# EAGLE design 308_usb_memory (EAGLE 9.6.2)
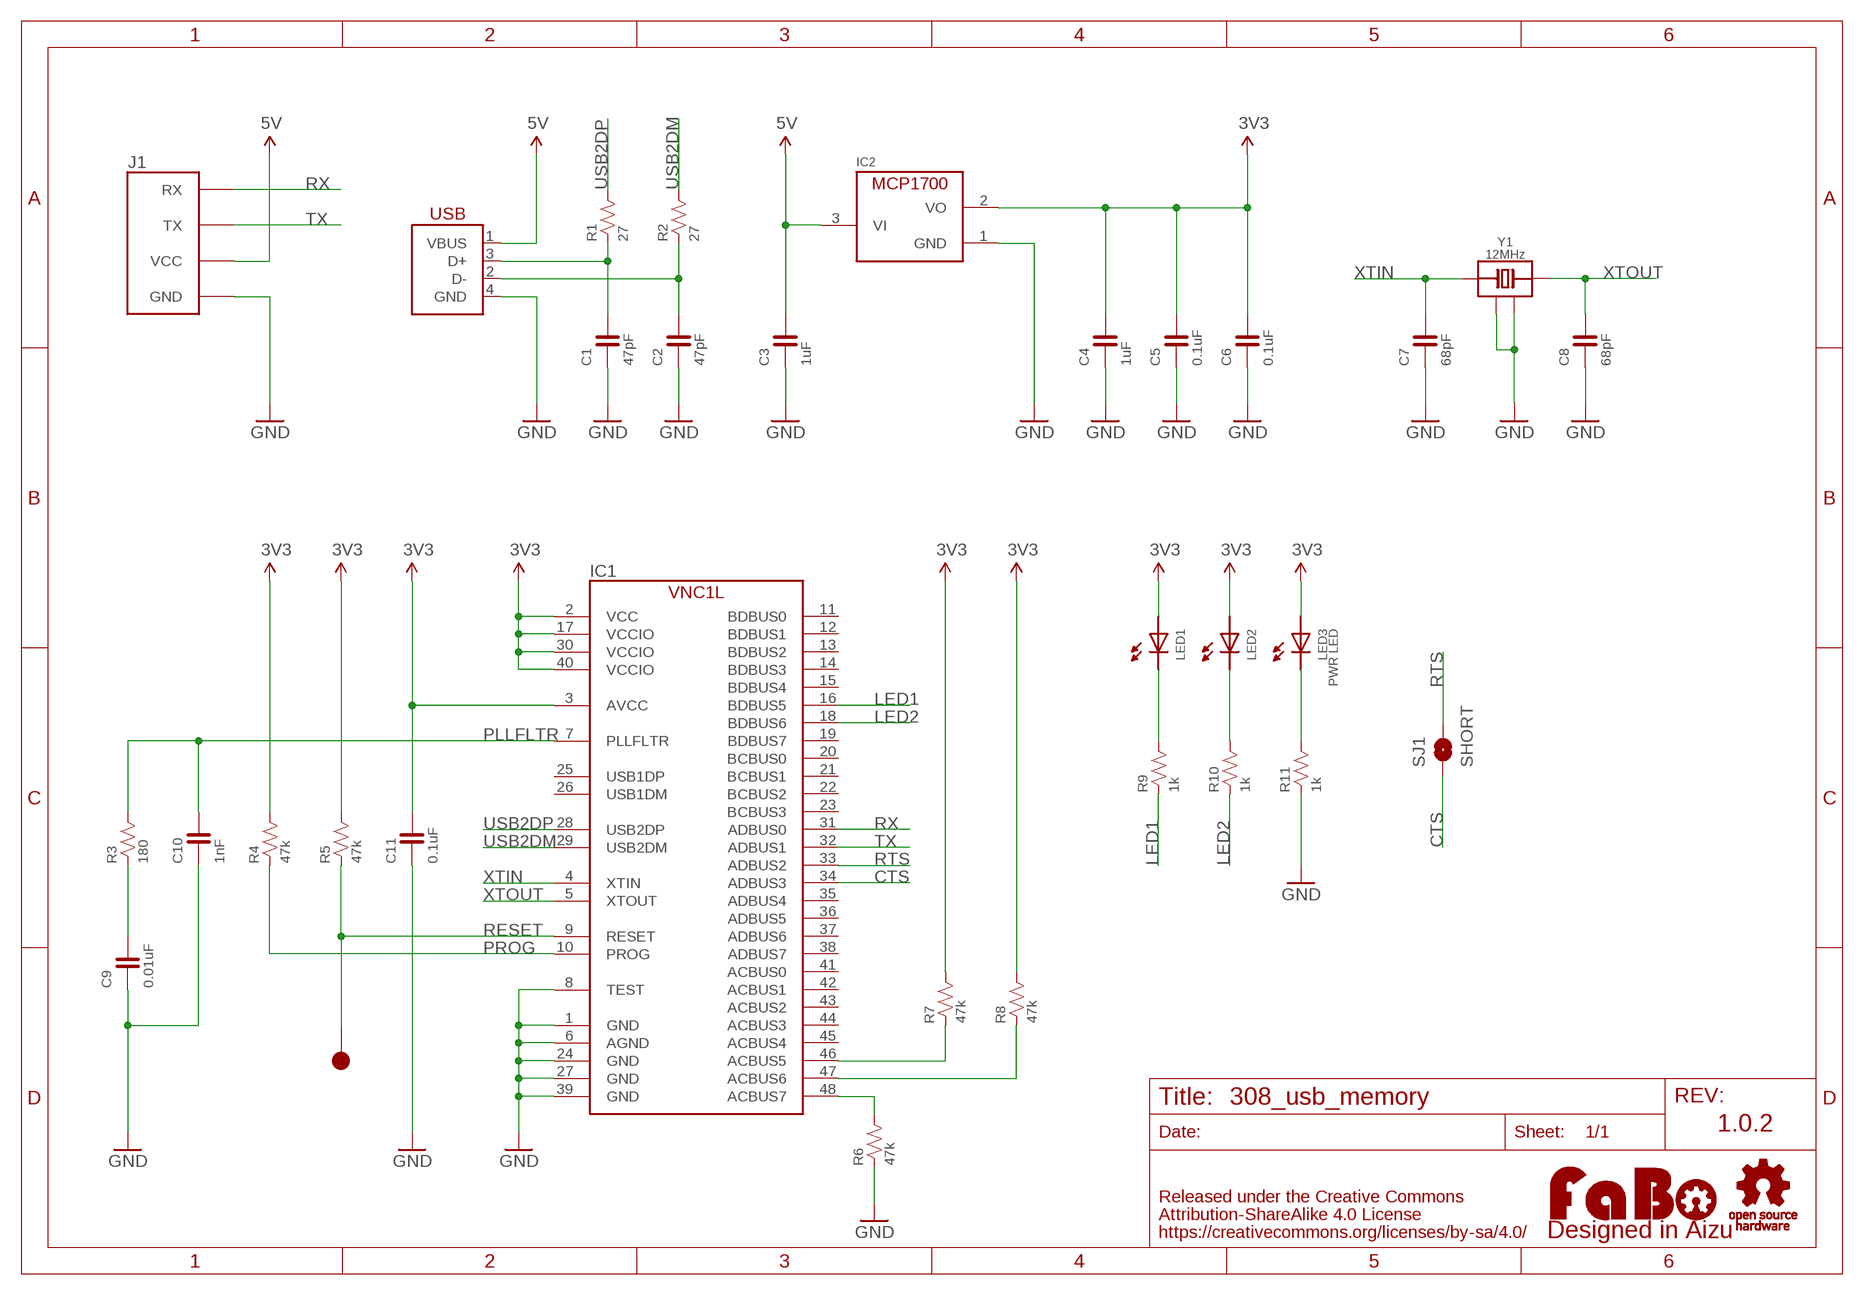
[diagram p0: schematic, sheet 1]

## Parts
C1  47pF  CAPACITOR-0603_NARROW  [0603-NARROW]
C2  47pF  CAPACITOR-0603_NARROW  [0603-NARROW]
C3  1uF  CAPACITOR-0603_NARROW  [0603-NARROW]
C4  1uF  CAPACITOR-0603_NARROW  [0603-NARROW]
C5  0.1uF  CAPACITOR-0603_NARROW  [0603-NARROW]
C6  0.1uF  CAPACITOR-0603_NARROW  [0603-NARROW]
C7  68pF  CAPACITOR-0603_NARROW  [0603-NARROW]
C8  68pF  CAPACITOR-0603_NARROW  [0603-NARROW]
C9  0.01uF  CAPACITOR-0603_NARROW  [0603-NARROW]
C10  1nF  CAPACITOR-0603_NARROW  [0603-NARROW]
C11  0.1uF  CAPACITOR-0603_NARROW  [0603-NARROW]
IC1  VNC1L-1A  [LQFP-48]
IC2  MCP1700T-3302TT  [SOT-23]
J1  FABO_BRICK_SERIAL-2_HOLE  [FABO_BRICK_SERIAL_2HOLE]
LED1  LED-0603-NARROW  [0603-NARROW]
LED2  LED-0603-NARROW  [0603-NARROW]
LED3  PWR LED  LED-0603-NARROW  [0603-NARROW]
LOGO1  LOGO_FABO-M_BOTTOM  [LOGO_FABO_M_BOTTOM]
R1  27  RESISTOR-0603-NARROW  [0603-NARROW]
R2  27  RESISTOR-0603-NARROW  [0603-NARROW]
R3  180  RESISTOR-0603-NARROW  [0603-NARROW]
R4  47k  RESISTOR-0603-NARROW  [0603-NARROW]
R5  47k  RESISTOR-0603-NARROW  [0603-NARROW]
R6  47k  RESISTOR-0603-NARROW  [0603-NARROW]
R7  47k  RESISTOR-0603-NARROW  [0603-NARROW]
R8  47k  RESISTOR-0603-NARROW  [0603-NARROW]
R9  1k  RESISTOR-0603-NARROW  [0603-NARROW]
R10  1k  RESISTOR-0603-NARROW  [0603-NARROW]
R11  1k  RESISTOR-0603-NARROW  [0603-NARROW]
SJ1  SHORT  SMD-JUMPER-2-SHORT  [SMD-JUMPER-2-SHORT]
TP1  TP-15  [TP-15]
U$2  LOGO_OSHW-M_BOTTOM  [LOGO_OSHW_M_BOTTOM]
USB1  USB-B_PTH  [USB-4AF103BS]
Y1  12MHz  CRYSTAL-ECS-120-12-33Q  [ECS-12MHZ]

## Nets
3V3: C4.2 C5.2 C6.2 C11.2 IC1.2(VCC) IC1.3(AVCC) IC1.17(VCCIO) IC1.30(VCCIO) IC1.40(VCCIO) IC2.2(VO) LED1.ANODE LED2.ANODE LED3.ANODE R4.2 R5.2 R7.2 R8.2
5V: C3.2 IC2.3(VI) J1.VCC USB1.1(VBUS)
ACBUS5: IC1.46(ACBUS5) R7.1
ACBUS6: IC1.47(ACBUS6) R8.1
ACBUS7: IC1.48(ACBUS7) R6.2
CTS: IC1.34(ADBUS3) SJ1.2
GND: C1.1 C2.1 C3.1 C4.1 C5.1 C6.1 C7.1 C8.1 C9.1 C10.1 C11.1 IC1.1(GND) IC1.6(AGND) IC1.8(TEST) IC1.24(GND) IC1.27(GND) IC1.39(GND) IC2.1(GND) J1.GND R6.1 R11.1 USB1.4(GND) Y1.2(GND) Y1.4(GND)
LED1: IC1.16(BDBUS5) R9.1
LED2: IC1.18(BDBUS6) R10.1
N$2: C9.2 R3.1
N$3: C1.2 R1.1 USB1.3(D+)
N$4: C2.2 R2.1 USB1.2(D-)
N$9: LED2.CATHODE R10.2
N$10: LED1.CATHODE R9.2
N$11: LED3.CATHODE R11.2
PLLFLTR: C10.2 IC1.7(PLLFLTR) R3.2
PROG: IC1.10(PROG) R4.1
RESET: IC1.9(RESET) R5.1 TP1.1
RTS: IC1.33(ADBUS2) SJ1.1
RX: IC1.31(ADBUS0) J1.RX
TX: IC1.32(ADBUS1) J1.TX
USB2DM: IC1.29(USB2DM) R2.2
USB2DP: IC1.28(USB2DP) R1.2
XTIN: C7.2 IC1.4(XTIN) Y1.1(IO)
XTOUT: C8.2 IC1.5(XTOUT) Y1.3(IO)
Unconnected: IC1.11(BDBUS0) IC1.12(BDBUS1) IC1.13(BDBUS2) IC1.14(BDBUS3) IC1.15(BDBUS4) IC1.19(BDBUS7) IC1.20(BCBUS0) IC1.21(BCBUS1) IC1.22(BCBUS2) IC1.23(BCBUS3) IC1.25(USB1DP) IC1.26(USB1DM) IC1.35(ADBUS4) IC1.36(ADBUS5) IC1.37(ADBUS6) IC1.38(ADBUS7) IC1.41(ACBUS0) IC1.42(ACBUS1) IC1.43(ACBUS2) IC1.44(ACBUS3) IC1.45(ACBUS4)

## Notes on the sheet
- 1.0.2

## Library data of the parts
C1-C11 = FaBo-Capacitor:CAPACITOR: CAPACITOR
IC1 = FaBo-USB:VNC1L
IC2 = FaBo-Supply:MCP1700
J1 = FaBo-Template:FABO_BRICK_SERIAL: FaBo Brick Serial
LED1-LED3 = FaBo-LED:LED
LOGO1 = component:LOGO_FABO
R1-R11 = FaBo-Resistors:RESISTOR: RESISTOR
SJ1 = FaBo-Supply:SMD-JUMPER-2
TP1 = FaBo-Supply:TP
U$2 = FaBo-Logo:LOGO_OSHW
USB1 = FaBo-USB:USB
Y1 = FaBo-Crystal:CRYSTAL-ECS

## Board
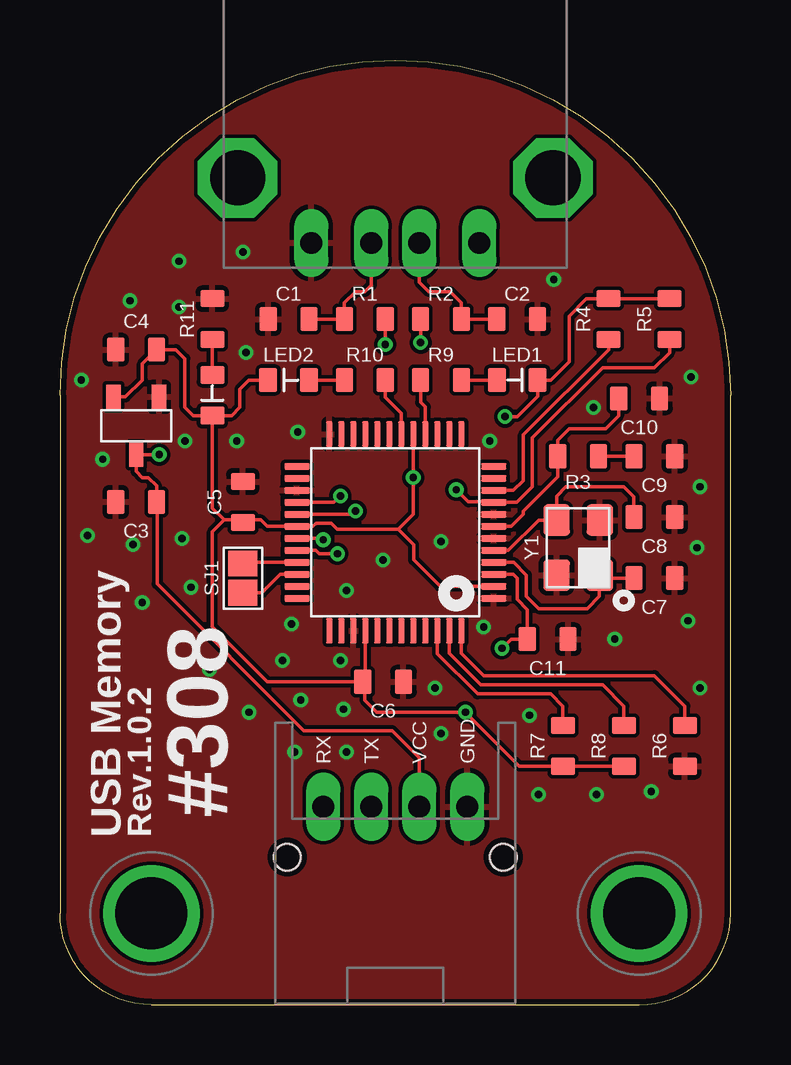
[diagram p1: board, top side]
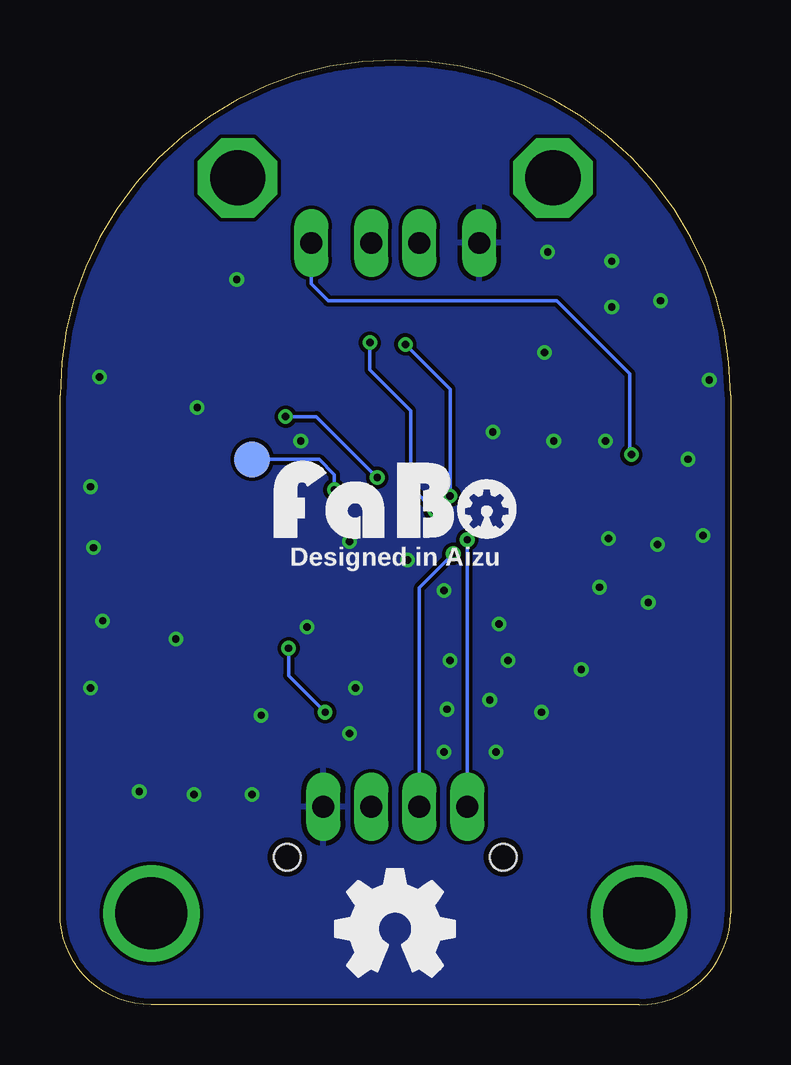
[diagram p2: board, bottom side, seen from below]

Size 27.94 x 39.37 mm. Coordinates in mm from the lower left corner, seen from the top.
Copper layers (1*16): Top 0.035mm / dielectric 1.6mm / Bottom 0.035mm
Design rules "PCBway": minimum track width 6mil, minimum drill 12mil, track to track 6mil, track to pad 6mil, pad to pad 6mil, via to via 6mil, smd to smd 6mil, copper to edge 10mil, drill to drill 10mil, minimum pad ring 10mil, minimum via ring 6mil, stop-mask expansion 2mil, vias tented up to drill 100mil, thermal gap 8mil

### Footprints (pad centres in the part's own frame; a part is rotated, then mirrored left to right if it is on the bottom)
0603-NARROW = smd 0.71 x 1: 1 -0.85,0; 2 0.85,0
LQFP-48 = smd 0.27 x 1.05: 1 -2.75,-4.1; 2 -2.25,-4.1; 3 -1.75,-4.1; 4 -1.25,-4.1; 5 -0.75,-4.1; 6 -0.25,-4.1; 7 0.25,-4.1; 8 0.75,-4.1; 9 1.25,-4.1; 10 1.75,-4.1; 11 2.25,-4.1; 12 2.75,-4.1; 25 2.75,4.1; 26 2.25,4.1; 27 1.75,4.1; 28 1.25,4.1; 29 0.75,4.1; 30 0.25,4.1; 31 -0.25,4.1; 32 -0.75,4.1; 33 -1.25,4.1; 34 -1.75,4.1; 35 -2.25,4.1; 36 -2.75,4.1 | smd 1.05 x 0.27: 13 4.1,-2.75; 14 4.1,-2.25; 15 4.1,-1.75; 16 4.1,-1.25; 17 4.1,-0.75; 18 4.1,-0.25; 19 4.1,0.25; 20 4.1,0.75; 21 4.1,1.25; 22 4.1,1.75; 23 4.1,2.25; 24 4.1,2.75; 37 -4.1,2.75; 38 -4.1,2.25; 39 -4.1,1.75; 40 -4.1,1.25; 41 -4.1,0.75; 42 -4.1,0.25; 43 -4.1,-0.25; 44 -4.1,-0.75; 45 -4.1,-1.25; 46 -4.1,-1.75; 47 -4.1,-2.25; 48 -4.1,-2.75
SOT-23 = smd 0.6 x 1: 1 -0.95,-1.2; 2 0.95,-1.2; 3 0,1.2
FABO_BRICK_SERIAL_2HOLE = drill 0.9 pad 1.422 long: GND 3,-10.795; RX -3,-10.795; TX -1,-10.795; VCC 1,-10.795 | drill 3 pad 3.81: P$1 -10.16,-15.24; P$2 10.16,-15.24 | hole 1.1: -4.5,-12.895; 4.5,-12.895
0603-NARROW' = smd 0.75 x 1: ANODE -0.85,0; CATHODE 0.85,0
SMD-JUMPER-2-SHORT = smd 1.067 x 1.2: 1 -0.61,0; 2 0.61,0
TP-15 = smd 1.5 x 1.5: 1 0,0
USB-4AF103BS = drill 0.9 long: 1 3.5,0; 2 1,0; 3 -1,0; 4 -3.5,0 | drill 2.3 octagon: P$1 -6.57,2.71; P$2 6.57,2.71
ECS-12MHZ = smd 1.3 x 1.1: 1 -1.15,-0.9; 2 1.15,-0.9; 3 1.15,0.9; 4 -1.15,0.9

### Placement (x,y rotation side)
C1  9.53,28.57 0 top
C2  19.05,28.57 180 top
C3  3.17,20.95 0 top
C4  3.17,27.3 0 top
C5  7.62,20.95 270 top
C6  13.46,13.46 180 top
C7  24.77,17.78 180 top
C8  24.77,20.32 180 top
C9  24.77,22.86 180 top
C10  24.13,25.27 180 top
C11  20.32,15.24 180 top
IC1  13.97,19.68 90 top
IC2  3.17,24.13 180 top
J1  13.97,19.05 0 top
LED1  [0603-NARROW']  19.05,26.04 180 top
LED2  [0603-NARROW']  9.53,26.04 0 top
LED3  PWR LED  [0603-NARROW']  6.35,25.4 90 top
LOGO1  13.97,19.05 0 top
R1  12.7,28.57 0 top
R2  15.88,28.57 180 top
R3  21.59,22.86 180 top
R4  22.86,28.57 90 top
R5  25.4,28.57 90 top
R6  26.04,10.79 90 top
R7  20.95,10.79 270 top
R8  23.5,10.79 270 top
R9  15.88,26.04 0 top
R10  12.7,26.04 180 top
R11  6.35,28.57 270 top
SJ1  7.62,17.78 270 top
TP1  19.94,22.73 0 bottom
U$2  13.97,3.17 0 top
USB1  13.97,31.75 0 top
Y1  21.59,19.05 90 top

### Tracks (layer width: path | path; a pad name or v marks a point on that pad's centre or on a via)
3V3  (via drill 0.3)
  Top 0.152: IC2.2 2.72,25.33 3.43,26.04 3.43,26.71 C4.2 4.83,27.3 5.21,26.92 5.21,24.89 5.55,24.55 LED3.ANODE | LED2.ANODE 7.87,26.04 7.49,25.65 7.49,24.89 7.15,24.55 LED3.ANODE | 6.85,20.2 6.35,20.7 LED3.ANODE | R5.2 R4.2 21.93,29.43 21.21,28.7 21.21,26.8 20.45,26.04 LED1.ANODE 19.9,25.36 19.05,24.51 v18.54,24.51 | R8.2 R7.2 19.14,9.95 v16.89,12.19 13.21,12.19 12.7,12.7 12.7,13.37 C6.2 | 6.85,20.2 6.35,19.71 6.35,15.75 8.64,13.46 C6.2 | IC1.3 18.89,17.93 19.05,17.78 19.05,16.89 19.47,16.47 C11.2 18.8,15.24 v18.41,14.86 | 14.1,19.81 11.56,19.81 11.3,20.07 10.67,20.07 10.54,19.93 IC1.30 8.64,19.93 8.37,20.2 7.72,20.2 C5.2 7.52,20.2 6.85,20.2 | IC1.2 15.84,17.43 14.73,18.54 14.73,19.18 14.1,19.81 | IC1.17 v14.72,21.97 14.72,20.43 14.1,19.81 | C6.2 12.72,13.57 IC1.40
  Bottom 0.152: v18.41,14.86 18.41,13.72 v16.89,12.19 | v18.54,24.51 17.26,24.51 v14.72,21.97
5V  (via drill 0.3)
  Top 0.152: J1.VCC 14.97,10.3 13.84,11.43 10.16,11.43 4.05,17.54 4.05,20.93 C3.2 4.03,21.63 3.68,21.97 3.43,21.97 3.17,22.23 IC2.3 v4.13,22.93
  Bottom 0.152: USB1.1 17.47,30.04 16.76,29.34 7.24,29.34 4.19,26.29 4.19,22.99 v4.13,22.93
ACBUS5
  Top 0.152: IC1.46 15.72,14.63 17.4,12.95 20.45,12.95 20.95,12.45 R7.1
ACBUS6
  Top 0.152: IC1.47 16.22,14.64 17.53,13.34 22.61,13.34 23.5,12.45 R8.1
ACBUS7
  Top 0.152: IC1.48 16.72,14.65 17.65,13.72 24.77,13.72 26.04,12.45 R6.2
CTS
  Top 0.152: SJ1.2 8.41,17.17 9.17,17.93 IC1.34
GND  (via drill 0.3)
  other vias: 11.94,17.27 17.91,23.5 17.65,15.75 15.62,13.21 19.56,12.06 23.11,15.24 11.68,14.35 11.81,12.32 11.94,10.54 9.78,10.54 10.03,12.7 9.27,14.35 9.65,15.88 5.46,17.4 6.22,13.97 3.43,16.76 3.05,19.18 5.08,19.43 5.21,23.5 7.37,23.5 9.91,23.88 15.88,19.3 13.46,18.54 22.23,24.89 4.95,29.08 2.92,29.34 1.78,22.73 15.88,11.3 19.94,8.76 7.87,12.19 26.29,26.16 26.67,21.59 26.54,19.05 26.16,16 26.67,13.21 24.64,8.89 22.35,8.76 1.14,19.56 0.89,26.04 7.62,31.37 20.57,30.23 7.75,27.18 4.95,30.99
  pour Bottom: 0,0 27.94,0 27.94,39.37 0,39.37
  pour Top: 0,0 27.94,0 27.94,39.37 0,39.37
LED1
  Top 0.152: R9.1 15.03,25.11 15.22,24.91 IC1.16
LED2
  Top 0.152: IC1.18 14.22,24.64 13.55,25.31 R10.1
N$2
  Top 0.152: R3.1 C9.2
N$3
  Top 0.152: C1.2 R1.1 11.85,29.25 12.32,29.72 12.7,29.72 12.97,29.99 USB1.3
N$4
  Top 0.152: C2.2 R2.1 16.73,29.25 16.26,29.72 15.37,29.72 14.97,30.11 USB1.2
N$9
  Top 0.152: LED2.CATHODE R10.2
N$10
  Top 0.152: LED1.CATHODE R9.2
N$11
  Top 0.152: LED3.CATHODE R11.2
PLLFLTR
  Top 0.152: IC1.7 18.79,19.93 19.3,20.45 19.3,20.57 20.74,22.01 R3.2 20.74,23.53 21.21,24 22.73,24 23.28,24.55 C10.2
PROG
  Top 0.152: IC1.10 18.89,21.43 19.3,21.84 19.3,23.75 22.86,27.3 R4.1
RESET  (via drill 0.3)
  Top 0.152: R5.1 25.4,27.18 24.77,26.54 22.61,26.54 19.68,23.62 19.68,21.59 19.03,20.93 IC1.9 18.05,20.95 17.02,20.95 v16.51,21.46
  Bottom 0.152: TP1.1 17.14,22.73 16.51,22.1 v16.51,21.46
RTS
  Top 0.152: IC1.33 7.67,18.43 SJ1.1
RX  (via drill 0.3)
  Top 0.152: IC1.31 10.92,19.43 v10.97,19.38
  Bottom 0.152: J1.RX v10.97,19.38
TX  (via drill 0.3)
  Top 0.152: IC1.32 10.66,18.93 10.79,18.8 v11.56,18.8
  Bottom 0.152: J1.TX 12.97,17.38 v11.56,18.8
USB2DM  (via drill 0.3)
  Top 0.152: IC1.29 12.18,20.43 v12.32,20.57 | R2.2 v15.03,27.6
  Bottom 0.152: v12.32,20.57 13.34,21.59 13.34,24.77 15.03,26.45 v15.03,27.6
USB2DP  (via drill 0.3)
  Top 0.152: IC1.28 11.41,20.93 v11.68,21.21 | R1.2 v13.55,27.52
  Bottom 0.152: v11.68,21.21 11.68,25.65 v13.55,27.52
XTIN
  Top 0.152: IC1.4 18.9,18.43 19.43,17.91 19.43,17.02 19.94,16.51 21.97,16.51 22.48,17.02 22.48,17.89 Y1.1 22.61,17.78 C7.2
XTOUT
  Top 0.152: IC1.5 18.68,18.93 19.95,20.2 Y1.3 20.69,21.2 21.08,21.59 23.5,21.59 23.91,21.17 C8.2

### Text on the board
tPlace: #308 | USB Memory | Rev.1.0.2
bPlace: Designed in Aizu